# EAGLE design SprinklerBoard-8p (EAGLE 6.5.0)
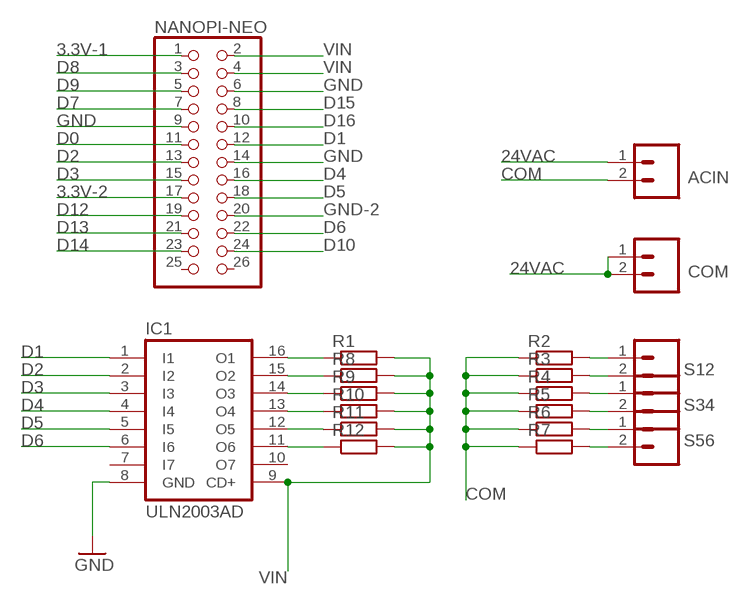
[diagram p0: schematic, sheet 1]

## Parts
ACIN  M025MM-X  [SCREWTERMINAL-5MM-2-X]
COM  M025MM-X  [SCREWTERMINAL-5MM-2-X]
IC1  ULN2003AD  [SO16]
NANOPI-NEO  PINHD-2X13  [2X13]
R1  R-EU_0204/5  [0204/5]
R2  R-EU_0207/15  [0207/15]
R3  R-EU_0207/15  [0207/15]
R4  R-EU_0207/15  [0207/15]
R5  R-EU_0207/15  [0207/15]
R6  R-EU_0207/15  [0207/15]
R7  R-EU_0207/15  [0207/15]
R8  R-EU_0204/5  [0204/5]
R9  R-EU_0204/5  [0204/5]
R10  R-EU_0204/5  [0204/5]
R11  R-EU_0204/5  [0204/5]
R12  R-EU_0204/5  [0204/5]
S12  M025MM-X  [SCREWTERMINAL-5MM-2-X]
S34  M025MM-X  [SCREWTERMINAL-5MM-2-X]
S56  M025MM-X  [SCREWTERMINAL-5MM-2-X]

## Nets
3.3V-1: NANOPI-NEO.1
3.3V-2: NANOPI-NEO.17
24VAC [power]: ACIN.1 COM.1 COM.2
COM [power]: ACIN.2 R2.1 R3.1 R4.1 R5.1 R6.1 R7.1
D0: NANOPI-NEO.11
D1: IC1.1(I1) NANOPI-NEO.12
D2: IC1.2(I2) NANOPI-NEO.13
D3: IC1.3(I3) NANOPI-NEO.15
D4: IC1.4(I4) NANOPI-NEO.16
D5: IC1.5(I5) NANOPI-NEO.18
D6: IC1.6(I6) NANOPI-NEO.22
D7: NANOPI-NEO.7
D8: NANOPI-NEO.3
D9: NANOPI-NEO.5
D10: NANOPI-NEO.24
D12: NANOPI-NEO.19
D13: NANOPI-NEO.21
D14: NANOPI-NEO.23
D15: NANOPI-NEO.8
D16: NANOPI-NEO.10
GND [power]: IC1.8(GND) NANOPI-NEO.6 NANOPI-NEO.9 NANOPI-NEO.14
GND-2 [power]: NANOPI-NEO.20
N$1: R2.2 S12.1
N$2: R3.2 S12.2
N$3: R4.2 S34.1
N$4: R5.2 S34.2
N$5: R6.2 S56.1
N$6: R7.2 S56.2
N$7: IC1.16(O1) R1.1
N$8: IC1.15(O2) R8.1
N$9: IC1.14(O3) R9.1
N$10: IC1.13(O4) R10.1
N$11: IC1.12(O5) R11.1
N$12: IC1.11(O6) R12.1
VIN [power]: IC1.9(CD+) NANOPI-NEO.2 NANOPI-NEO.4 R1.2 R8.2 R9.2 R10.2 R11.2 R12.2
Unconnected: IC1.7(I7) IC1.10(O7) NANOPI-NEO.25 NANOPI-NEO.26

## Library data of the parts
ACIN COM S12 S34 S56 = SparkFun:M02: Header 2 Standard 2-pin 0.1" header. Use with straight break away headers (SKU : PRT-00116), right angle break away headers (PRT-00553), swiss pins (PRT-00743), machine pins (PRT-00117), and female headers (PRT-00115). Molex polarized connector foot print use with SKU : PRT-08233 with associated crimp pins and housings.
IC1 = uln-udn:ULN2003A: DRIVER ARRAY
NANOPI-NEO = pinhead:PINHD-2X13: PIN HEADER
R1-R12 = resistor:R-EU_: RESISTOR, European symbol

## Net classes
0 default: width 0.178 mm, clearance 0.178 mm
1 power: width 0.406 mm, clearance 0.203 mm
2 relay power: width 0.508 mm, clearance 0.305 mm

## Board
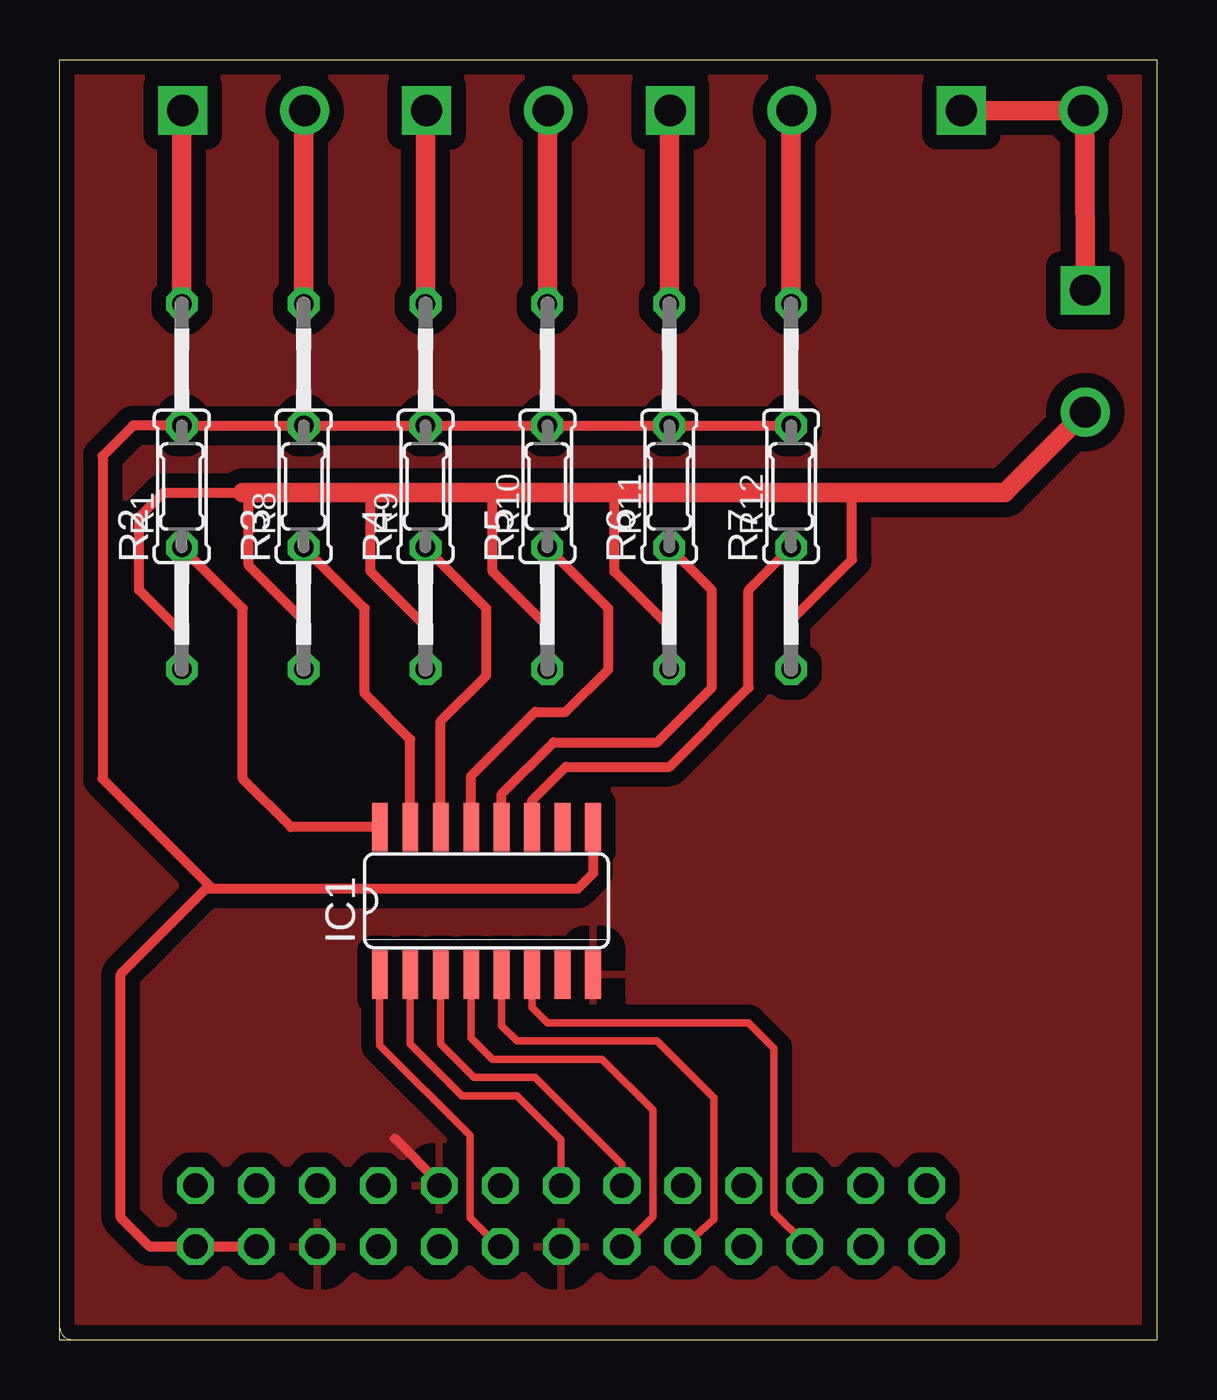
[diagram p1: board, top side]
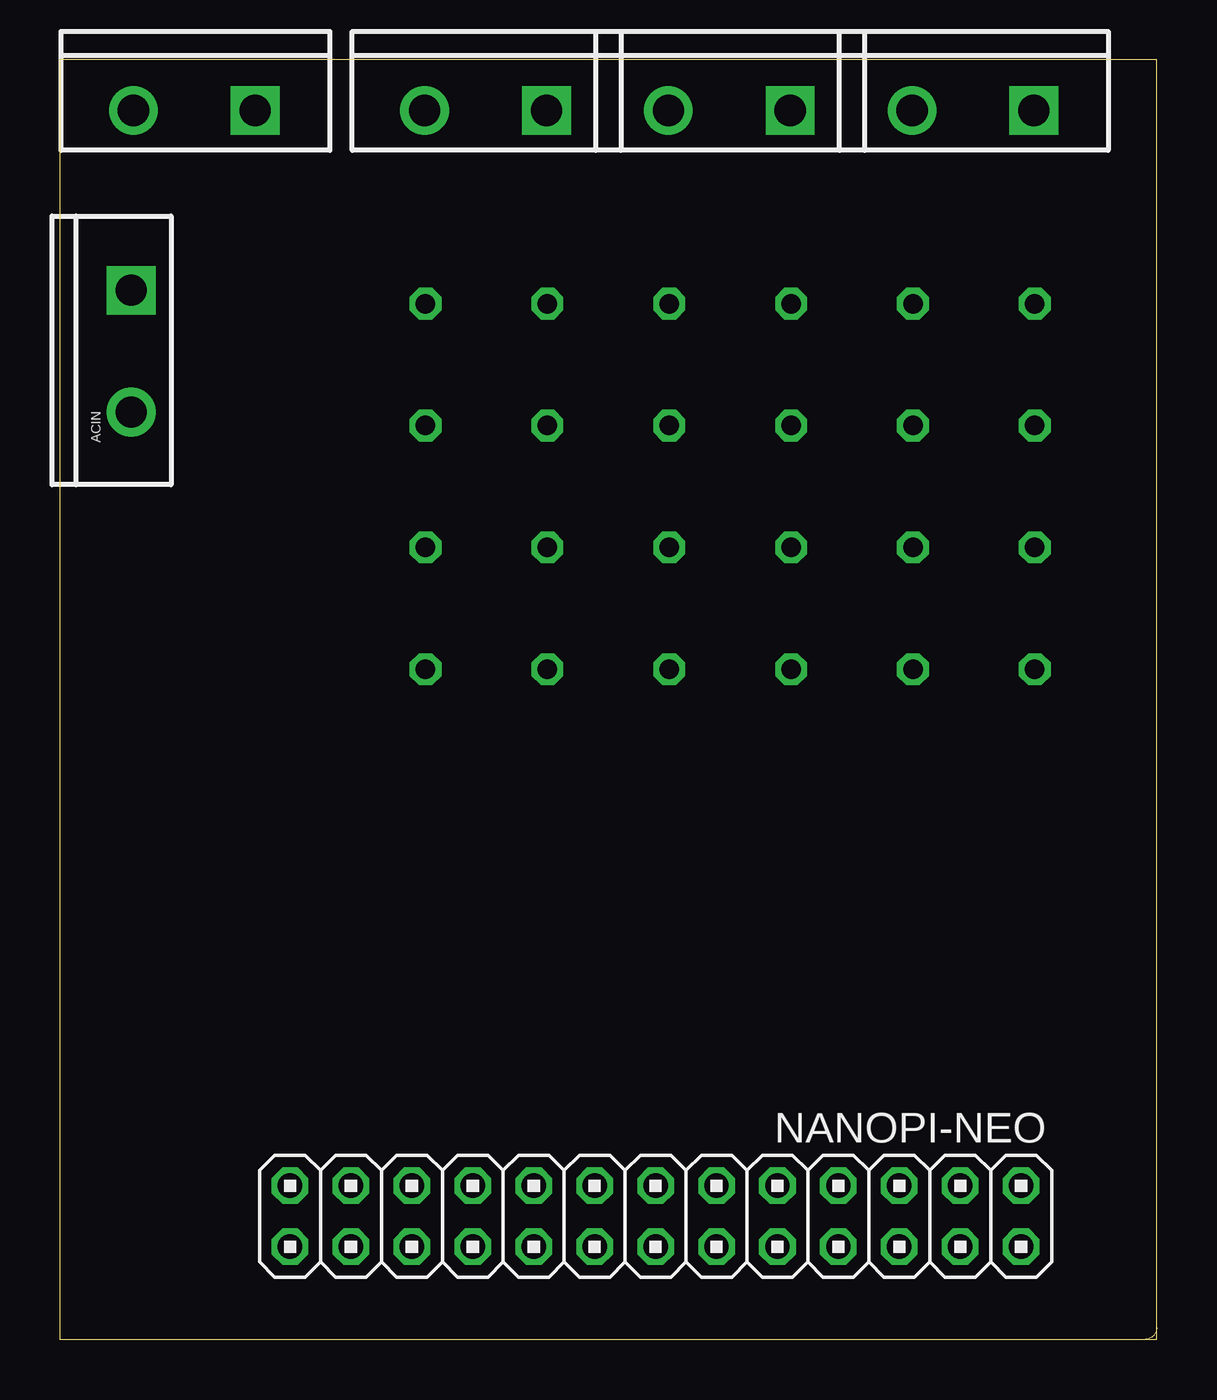
[diagram p2: board, bottom side, seen from below]

Size 45.72 x 53.34 mm. Coordinates in mm from the lower left corner, seen from the top.
Outline: 0,0.5 arc90 0.5,0
Outline: 0,0 45.72,0 45.72,53.34 0,53.34 0,0
Copper layers (1*16): Top 0.035mm / dielectric 1.5mm / Bottom 0.035mm
Design rules "Fusion_eagle_rule_v1.1 *": minimum track width 6mil, minimum drill 12mil, track to track 6mil, track to pad 6mil, pad to pad 6mil, via to via 6mil, smd to smd 0mil, copper to edge 10mil, drill to drill 10mil, minimum pad ring 10mil, minimum via ring 6mil, stop-mask expansion 2mil, vias tented up to drill 100mil, thermal gap 40mil

### Footprints (pad centres in the part's own frame; a part is rotated, then mirrored left to right if it is on the bottom)
SCREWTERMINAL-5MM-2-X = drill 1.3 pad 2.032 square: 1 0,0 | drill 1.3 pad 2.032: 2 5.08,0
SO16 = smd 0.66 x 2.032: 1 -4.445,-3.073; 2 -3.175,-3.073; 3 -1.905,-3.073; 4 -0.635,-3.073; 5 0.635,-3.073; 6 1.905,-3.073; 7 3.175,-3.073; 8 4.445,-3.073; 9 4.445,3.073; 10 3.175,3.073; 11 1.905,3.073; 12 0.635,3.073; 13 -0.635,3.073; 14 -1.905,3.073; 15 -3.175,3.073; 16 -4.445,3.073
2X13 = drill 1.016 octagon: 1 -15.24,-1.27; 2 -15.24,1.27; 3 -12.7,-1.27; 4 -12.7,1.27; 5 -10.16,-1.27; 6 -10.16,1.27; 7 -7.62,-1.27; 8 -7.62,1.27; 9 -5.08,-1.27; 10 -5.08,1.27; 11 -2.54,-1.27; 12 -2.54,1.27; 13 0,-1.27; 14 0,1.27; 15 2.54,-1.27; 16 2.54,1.27; 17 5.08,-1.27; 18 5.08,1.27; 19 7.62,-1.27; 20 7.62,1.27; 21 10.16,-1.27; 22 10.16,1.27; 23 12.7,-1.27; 24 12.7,1.27; 25 15.24,-1.27; 26 15.24,1.27
0204/5 = drill 0.813 octagon: 1 -2.54,0; 2 2.54,0
0207/15 = drill 0.813 octagon: 1 -7.62,0; 2 7.62,0

### Placement (x,y rotation side)
ACIN  42.75,43.74 270 bottom
COM  37.58,51.23 180 bottom
IC1  17.78,18.29 0 top
NANOPI-NEO  20.89,5.14 180 bottom
R1  5.08,35.56 90 top
R2  5.08,35.56 90 top
R3  10.16,35.56 90 top
R4  15.24,35.56 90 top
R5  20.32,35.56 90 top
R6  25.4,35.56 90 top
R7  30.48,35.56 90 top
R8  10.16,35.56 90 top
R9  15.24,35.56 90 top
R10  20.32,35.56 90 top
R11  25.4,35.56 90 top
R12  30.48,35.56 90 top
S12  5.12,51.23 180 bottom
S34  15.28,51.23 180 bottom
S56  25.44,51.23 180 bottom

### Tracks (layer width: path | path; a pad name or v marks a point on that pad's centre or on a via)
24VAC
  Top 0.813: ACIN.1 42.73,50.04 COM.2 COM.1
COM
  Top 0.406: R3.1 10.16,29.97 7.87,32.26 7.87,35.05 7.62,35.31 4.32,35.31 3.3,34.29 3.3,31.24 5.08,29.46 R2.1 | R4.1 15.24,29.72 12.95,32 12.95,35.31 | R5.1 20.32,29.72 18.03,32 18.03,35.31 | R6.1 25.4,29.72 23.11,32 23.11,35.05 22.86,35.31 | R7.1 30.48,29.97 33.02,32.51 33.02,35.05 33.27,35.31
  Top 0.813: 7.62,35.31 12.95,35.31 18.03,35.31 22.86,35.31 33.27,35.31 39.4,35.31 ACIN.2
D1
  Top 0.305: NANOPI-NEO.12 18.3,3.87 17.09,5.08 17.09,8.51 13.34,12.27 IC1.1
D2
  Top 0.305: NANOPI-NEO.13 20.89,8.32 19.05,10.16 16.76,10.16 14.61,12.32 IC1.2
D3
  Top 0.305: NANOPI-NEO.15 23.43,7.3 19.81,10.92 17.27,10.92 15.88,12.32 IC1.3
D4
  Top 0.305: IC1.4 17.14,12.57 18.03,11.68 22.61,11.68 24.71,9.58 24.71,5.11 23.48,3.87 NANOPI-NEO.16
D5
  Top 0.305: IC1.5 18.41,13.08 19.05,12.45 24.89,12.45 27.25,10.08 27.25,5 NANOPI-NEO.18
D6
  Top 0.305: IC1.6 19.68,13.84 20.32,13.21 28.7,13.21 29.77,12.14 29.77,5.28 31.05,4 NANOPI-NEO.22
GND
  Top 0.406: NANOPI-NEO.9 15.81,6.54 13.97,8.38
  pour Top (isolate 0.61): 0,0 45.72,0 45.72,53.34 0,53.34
N$1
  Top 0.813: R2.2 5.08,49.92 S12.1
N$2
  Top 0.813: R3.2 10.16,49.92 S12.2
N$3
  Top 0.813: R4.2 15.24,49.92 S34.1
N$4
  Top 0.813: R5.2 20.32,49.92 S34.2
N$5
  Top 0.813: R6.2 25.4,49.92 S56.1
N$6
  Top 0.813: R7.2 30.48,49.92 S56.2
N$7
  Top 0.406: IC1.16 9.63,21.36 7.62,23.37 7.62,30.48 R1.1
N$8
  Top 0.406: IC1.15 14.61,25.02 12.7,26.92 12.7,30.48 R8.1
N$9
  Top 0.406: IC1.14 15.88,25.78 17.78,27.69 17.78,30.48 R9.1
N$10
  Top 0.406: IC1.13 17.14,23.5 19.81,26.16 21.08,26.16 22.86,27.94 22.86,30.48 R10.1
N$11
  Top 0.406: IC1.12 18.41,22.73 20.57,24.89 24.89,24.89 27.18,27.18 27.18,31.24 R11.1
N$12
  Top 0.406: IC1.11 19.68,22.48 21.08,23.88 25.4,23.88 28.7,27.18 28.7,31.24 R12.1
VIN
  Top 0.406: NANOPI-NEO.2 NANOPI-NEO.4 3.75,3.87 2.54,5.08 2.54,15.24 6.1,18.8 6.35,18.8 | 6.35,18.8 21.59,18.8 22.23,19.43 IC1.9 22.35,21.23 | R12.2 R11.2 R10.2 R9.2 R8.2 R1.2 3.05,38.1 1.78,36.83 1.78,23.37 6.35,18.8